# Altium schematic sheet 键盘外设_2023-05-27.schdoc
size 307 x 208 mm
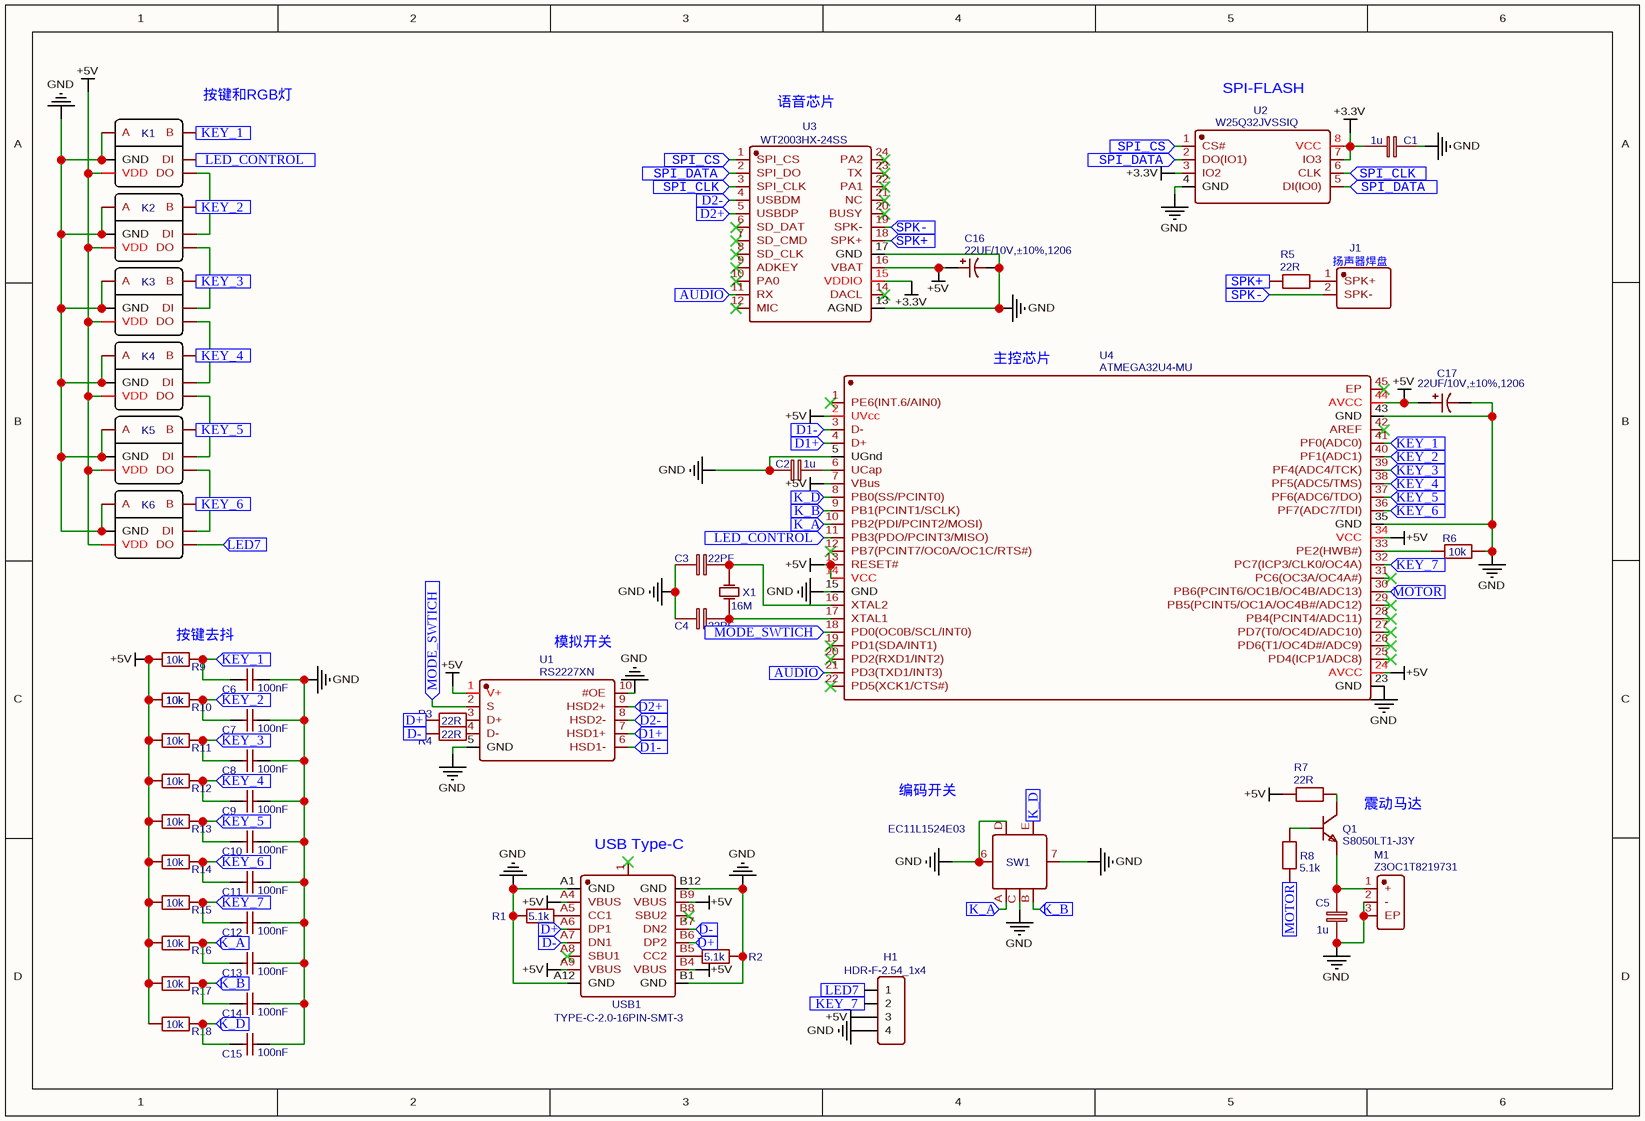
[diagram p0: 键盘外设_2023-05-27.schdoc]

## Parts
C1  1u  [0603]
C2  1u  [0603]
C3  22PF  [C0603]
C4  22PF  [C0603]
C5  1u  [0603]
C6  100nF  [C0603]
C7  100nF  [C0603]
C8  100nF  [C0603]
C9  100nF  [C0603]
C10  100nF  [C0603]
C11  100nF  [C0603]
C12  100nF  [C0603]
C13  100nF  [C0603]
C14  100nF  [C0603]
C15  100nF  [C0603]
C16  22UF/10V,±10%,1206  [CAP-SMD_L3.2-W1.6-FD-1]
C17  22UF/10V,±10%,1206  [CAP-SMD_L3.2-W1.6-FD-1]
H1  HDR-F-2.54_1x4  [HDR-F-2.54_1X4]
J1  扬声器焊盘  [扬声器焊盘]
K1  热插拔键轴-WS2812B  [热插拔键轴-WS2812B-2020]  (value not drawn)
K2  热插拔键轴-WS2812B  [热插拔键轴-WS2812B-2020]  (value not drawn)
K3  热插拔键轴-WS2812B  [热插拔键轴-WS2812B-2020]  (value not drawn)
K4  热插拔键轴-WS2812B  [热插拔键轴-WS2812B-2020]  (value not drawn)
K5  热插拔键轴-WS2812B  [热插拔键轴-WS2812B-2020]  (value not drawn)
K6  热插拔键轴-WS2812B  [热插拔键轴-WS2812B-2020]  (value not drawn)
M1  Z3OC1T8219731  [VIBRATING-MOTOR-SMD_3P-C9900001680]
Q1  S8050LT1-J3Y  [SOT-23_L2.9-W1.3-P1.90-LS2.4-BR]
R1  5.1k  [0603]
R2  5.1k  [0603]
R3  22R  [R0805]
R4  22R  [R0805]
R5  22R  [R0805]
R6  10k  [0603]
R7  22R  [R0805]
R8  5.1k  [0603]
R9  10k  [0603]
R10  10k  [0603]
R11  10k  [0603]
R12  10k  [0603]
R13  10k  [0603]
R14  10k  [0603]
R15  10k  [0603]
R16  10k  [0603]
R17  10k  [0603]
R18  10k  [0603]
SW1  EC11L1524E03  [SW-TH_EC11L1524E03]
U1  RS2227XN  [MSOP-10_L3.0-W3.0-P0.50-LS5.0-BL]
U2  W25Q32JVSSIQ  [SOIC-8_L5.3-W5.3-P1.27-LS8.0-BL]
U3  WT2003HX-24SS  [SSOP-24_L8.7-W3.9-P0.64-LS6.0-BL-1]
U4  ATMEGA32U4-MU  [手焊QFN44]
USB1  TYPE-C-2.0-16PIN-SMT-3  [TYPE-C-SMD_TYPE-CF3.1]
X1  16M  [OSC-SMD_2P-L5.0-W3.2]

## Ports
AUDIO (in), D1+ (in), D1- (in), D2+ (in), D2- (in), D+ (in), D- (in), K_A (in), K_B (in), K_D (in), KEY_1 (in), KEY_2 (in), KEY_3 (in), KEY_4 (in), KEY_5 (in), KEY_6 (in), KEY_7 (in), LED7 (in), LED_CONTROL (in), MODE_SWTICH (in), MOTOR (in), SPI_CLK (in), SPI_CS (in), SPI_DATA (in), SPK+ (in), SPK- (in)

## Nets
+3.3V: C1.2 U2.3(IO2) U2.7(IO3) U2.8(VCC) U3.15(VDDIO)
+5V: C16.1 C17.1 H1.3 K1.VDD K2.VDD K3.VDD K4.VDD K5.VDD K6.VDD R7.2 R9.2 R10.2 R11.2 R12.2 R13.2 R14.2 R15.2 R16.2 R17.2 R18.2 U1.1(V+) U3.16(VBAT) U4.2(UVcc) U4.7(VBus) U4.13(RESET#) U4.14(VCC) U4.24(AVCC) U4.34(VCC) U4.44(AVCC) USB1.A4(VBUS) USB1.A9(VBUS) USB1.B4(VBUS) USB1.B9(VBUS)
GND: C1.1 C2.1 C3.1 C4.1 C5.1 C6.2 C7.2 C8.2 C9.2 C10.2 C11.2 C12.2 C13.2 C14.2 C15.2 C16.2 C17.2 H1.4 K1.A K1.GND K2.A K2.GND K3.A K3.GND K4.A K4.GND K5.A K5.GND K6.A K6.GND M1.2(-) M1.3(EP) R1.2 R2.2 R6.2 SW1.6(EH) SW1.7(EH) SW1.C SW1.D U1.5(GND) U1.10(#OE) U2.4(GND) U3.13(AGND) U3.17(GND) U4.5(UGnd) U4.15(GND) U4.23(GND) U4.35(GND) U4.43(GND) USB1.A1(GND) USB1.A12(GND) USB1.B1(GND) USB1.B12(GND)
AUDIO: U3.11(RX) U4.21(PD3(TXD1/INT3)) ; port AUDIO
D1+: U1.7(HSD1+) U4.4(D+) ; port D1+
D1-: U1.6(HSD1-) U4.3(D-) ; port D1-
D2+: U1.9(HSD2+) U3.5(USBDP) ; port D2+
D2-: U1.8(HSD2-) U3.4(USBDM) ; port D2-
D+: R3.1 USB1.A6(DP1) USB1.B6(DP2) ; port D+
D-: R4.1 USB1.A7(DN1) USB1.B7(DN2) ; port D-
K_A: C13.1 R16.1 SW1.A U4.10(PB2(PDI/PCINT2/MOSI)) ; port K_A
K_B: C14.1 R17.1 SW1.B U4.9(PB1(PCINT1/SCLK)) ; port K_B
K_D: C15.1 R18.1 SW1.E U4.8(PB0(SS/PCINT0)) ; port K_D
KEY_1: C6.1 K1.B R9.1 U4.41(PF0(ADC0)) ; port KEY_1
KEY_2: C7.1 K2.B R10.1 U4.40(PF1(ADC1)) ; port KEY_2
KEY_3: C8.1 K3.B R11.1 U4.39(PF4(ADC4/TCK)) ; port KEY_3
KEY_4: C9.1 K4.B R12.1 U4.38(PF5(ADC5/TMS)) ; port KEY_4
KEY_5: C10.1 K5.B R13.1 U4.37(PF6(ADC6/TDO)) ; port KEY_5
KEY_6: C11.1 K6.B R14.1 U4.36(PF7(ADC7/TDI)) ; port KEY_6
KEY_7: C12.1 H1.2 R15.1 U4.32(PC7(ICP3/CLK0/OC4A)) ; port KEY_7
LED7: H1.1 K6.DO ; port LED7
LED_CONTROL: K1.DI U4.11(PB3(PDO/PCINT3/MISO)) ; port LED_CONTROL
MODE_SWTICH: U1.2(S) U4.18(PD0(OC0B/SCL/INT0)) ; port MODE_SWTICH
MOTOR: R8.2 U4.30(PB6(PCINT6/OC1B/OC4B/ADC13)) ; port MOTOR
SPI_CLK: U2.6(CLK) U3.3(SPI_CLK) ; port SPI_CLK
SPI_CS: U2.1(CS#) U3.1(SPI_CS) ; port SPI_CS
SPI_DATA: U2.2(DO(IO1)) U2.5(DI(IO0)) U3.2(SPI_DO) ; port SPI_DATA
SPK+: R5.2 U3.18(SPK+) ; port SPK+
SPK-: J1.2(SPK-) U3.19(SPK-) ; port SPK-
NetC2_2: C2.2 U4.6(UCap)
NetC3_2: C3.2 U4.16(XTAL2) X1.2(OSC2)
NetC4_2: C4.2 U4.17(XTAL1) X1.1(OSC1)
NetC5_2: C5.2 M1.1(+) Q1.2
NetJ1_1: J1.1(SPK+) R5.1
NetK1_DO: K1.DO K2.DI
NetK2_DO: K2.DO K3.DI
NetK3_DO: K3.DO K4.DI
NetK4_DO: K4.DO K5.DI
NetK5_DO: K5.DO K6.DI
NetQ1_1: Q1.1 R8.1
NetQ1_3: Q1.3 R7.1
NetR1_1: R1.1 USB1.A5(CC1)
NetR2_1: R2.1 USB1.B5(CC2)
NetR3_2: R3.2 U1.3(D+)
NetR4_2: R4.2 U1.4(D-)
NetR6_1: R6.1 U4.33(PE2(HWB#))

Not connected (* = marked no-connect by the designer): U3 6(SD_DAT)* 7(SD_CMD)* 8(SD_CLK)* 9(ADKEY)* 10(PA0)* 12(MIC)* 14(DACL)* 20(BUSY)* 21(NC)* 22(PA1)* 23(TX)* 24(PA2)*; U4 1(PE6(INT.6/AIN0))* 12(PB7(PCINT7/OC0A/OC1C/RTS#))* 19(PD1(SDA/INT1))* 20(PD2(RXD1/INT2))* 22(PD5(XCK1/CTS#))* 25(PD4(ICP1/ADC8))* 26(PD6(T1/OC4D#/ADC9))* 27(PD7(T0/OC4D/ADC10))* 28(PB4(PCINT4/ADC11))* 29(PB5(PCINT5/OC1A/OC4B#/ADC12))* 31(PC6(OC3A/OC4A#))* 42(AREF)* 45(EP)*; USB1 1(EH)* A8(SBU1)* B8(SBU2)*

## Notes on the sheet
- (near K1) 按键和RGB灯
- (near U3) 语音芯片
- (near U2) SPI-FLASH
- (near U4) 主控芯片
- (near R9) 按键去抖
- (near U1) 模拟开关
- (near R10) 10k
- 编码开关
- (near USB1) USB Type-C
- 震动马达

## Library data of the parts
C1 C2 C5 = 1u: nameAlias: Value(F); spicePre: C; spiceSymbolName: Cap_0603_EU
C3 C4 = 22PF: nameAlias: Value(F); spicePre: C; spiceSymbolName: Cap_0603_EU
C6-C15 = 100nF: BOM_Manufacturer: FH; BOM_Manufacturer Part: 0603B104K500NT; nameAlias: Capacitance; BOM_Supplier: LCSC; BOM_Supplier Part: C30926; spicePre: C; spiceSymbolName: 0603B104K500NT
C16 C17 = 22UF/10V,±10%,1206: BOM_Manufacturer: null; BOM_Manufacturer Part: 22uF/10V,±10%,1206,钽电容; Contributor: LCSC; BOM_Supplier: LCSC; BOM_Supplier Part: C9900004911; BOM_JLCPCB Part Class: Extended Part; spicePre: U; spiceSymbolName: 22UF/10V,±10%,1206
H1 = HDR-F-2.54_1x4: Contributor: LCEDA_Lib; BOM_Supplier Part: C225501; BOM_Supplier: LCSC; spicePre: H; spiceSymbolName: HDR-F-2.54_1x4
J1 = 扬声器焊盘: Contributor: zhongcheng; spicePre: J; spiceSymbolName: 扬声器焊盘
K1-K6 = 热插拔键轴-WS2812B: Contributor: zedo_cn; spicePre: K; spiceSymbolName: 热插拔键轴-WS2812B
M1 = Z3OC1T8219731: BOM_Manufacturer: KOTL(金龙机电); Contributor: LCSC; BOM_Supplier: LCSC; BOM_Supplier Part: C2894731; BOM_Manufacturer Part: Z3OC1T8219731; BOM_JLCPCB Part Class: Extended Part; spicePre: M; spiceSymbolName: Z3OC1T8219731
Q1 = S8050LT1-J3Y: BOM_Manufacturer: FH(风华); Contributor: lcsc; BOM_Supplier: LCSC; BOM_Supplier Part: C2962087; BOM_Manufacturer Part: S8050LT1-J3Y; link: https://atta.szlcsc.com/upload/public/pdf/source/20220411/740B3F4857AB400E9826209E74F1EDA4.pdf; BOM_JLCPCB Part Class: Extended Part; spicePre: Q; spiceSymbolName: S8050LT1-J3Y
R1 R2 R8 = 5.1k: nameAlias: Value(Ω); spicePre: R; spiceSymbolName: Res_0603(1/10W)_EU
R3-R5 R7 = 22R: nameAlias: Value(Ω); spicePre: R; spiceSymbolName: Res_0603(1/10W)_EU
R6 R9-R18 = 10k: nameAlias: Value(Ω); spicePre: R; spiceSymbolName: Res_0603(1/10W)_EU
SW1 = EC11L1524E03: BOM_Manufacturer: ALPSALPINE(阿尔卑斯阿尔派); Contributor: LCSC; BOM_Supplier: LCSC; BOM_Supplier Part: C2687297; BOM_Manufacturer Part: EC11L1524E03; BOM_JLCPCB Part Class: Extended Part; spicePre: S; spiceSymbolName: EC11L1524E03
U1 = RS2227XN: BOM_Manufacturer: RUNIC(  ); Contributor: LCSC; BOM_Supplier: LCSC; BOM_Supplier Part: C255478; BOM_Manufacturer Part: RS2227XN; BOM_JLCPCB Part Class: Extended Part; spicePre: U; spiceSymbolName: RS2227XN
U2 = W25Q32JVSSIQ: BOM_Manufacturer: WINBOND; BOM_Supplier: LCSC; BOM_Manufacturer Part: W25Q32JVSSIQ; BOM_Supplier Part: C82344; spicePre: U; spiceSymbolName: W25Q32JVSSIQ
U3 = WT2003HX-24SS: BOM_Manufacturer: null; Contributor: LCSC; BOM_Supplier: LCSC; BOM_Supplier Part: C2841000; BOM_Manufacturer Part: WT2003HX-24SS; BOM_JLCPCB Part Class: Extended Part; spicePre: U; spiceSymbolName: WT2003HX-24SS
U4 = ATMEGA32U4-MU: BOM_Manufacturer: MICROCHIP; SMT Type: Extend; BOM_Supplier: LCSC; BOM_Manufacturer Part: ATMEGA32U4-MU; BOM_Supplier Part: C112161; BOM_JLCPCB SMD: Yes; spicePre: U; spiceSymbolName: ATMEGA32U4-MU
USB1 = TYPE-C-2.0-16PIN-SMT-3: BOM_Manufacturer: CIKI(皓富); Contributor: lcsc; BOM_Supplier: LCSC; BOM_Supplier Part: C2987386; BOM_Manufacturer Part: TYPE-C-2.0-16PIN-SMT-3; BOM_JLCPCB Part Class: Extended Part; spicePre: U; spiceSymbolName: TYPE-C-2.0-16PIN-SMT-3
X1 = 16M: BOM_Manufacturer: TXC Corp; BOM_Manufacturer Part: AA08000002; nameAlias: Frequency; Contributor: LCSC; BOM_Supplier: LCSC; BOM_Supplier Part: C331621; spicePre: X; spiceSymbolName: AA08000002